# EAGLE design stonyman-imager-board (EAGLE 6.5.0)
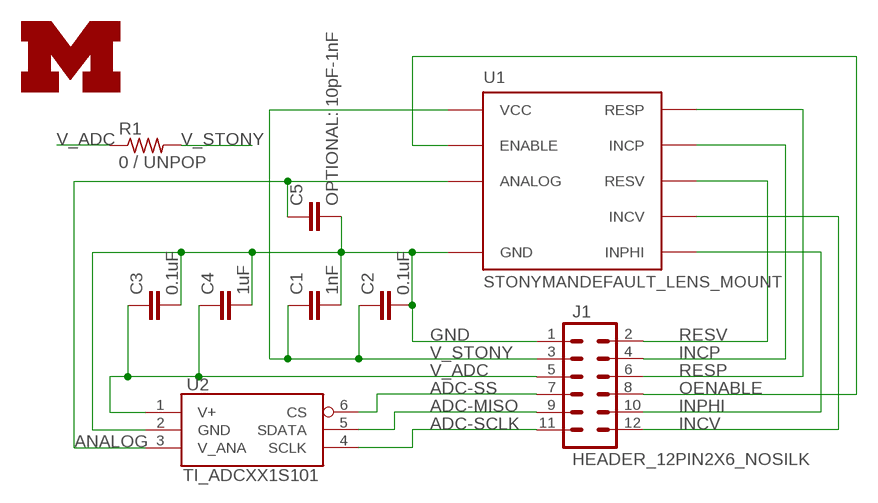
[diagram p0: schematic, sheet 1]

## Parts
C1  1nF  C-EUC0603  [C0603]
C2  0.1uF  C-EUC0603  [C0603]
C3  0.1uF  C-EUC0603  [C0603]
C4  1uF  C-EUC0603  [C0603]
C5  OPTIONAL: 10pF-1nF  C-EUC0603  [C0603]
J1  HEADER_12PIN2X6_NOSILK  [HEADER2X6/0.05IN_NO_SILK]
R1  0 / UNPOP  R-US_R0603  [R0603]
U1  STONYMANDEFAULT_LENS_MOUNT  [STONYMAN_DEFAULT_LENS]
U2  TI_ADCXX1S101  [SOT23-6]
U$1  UMICH_SOLID_SMALL  [UMICH_SOLID_75MIL]

## Nets
ADC-MISO: J1.9 U2.5(SDATA)
ADC-SCLK: J1.11 U2.4(SCLK)
ADC-SS: J1.7 U2.6(CS)
ANALOG: C5.1 U1.P$8(ANALOG) U2.3(V_ANA)
GND: C1.2 C2.2 C3.2 C4.2 C5.2 J1.1 U1.P$1(GND) U1.P$10(GND) U2.2(GND)
INCP: J1.4 U1.P$4(INCP)
INCV: J1.12 U1.P$6(INCV)
INPHI: J1.10 U1.P$7(INPHI)
OENABLE: J1.8 U1.P$9(ENABLE)
RESP: J1.6 U1.P$3(RESP)
RESV: J1.2 U1.P$5(RESV)
V_ADC: C3.1 C4.1 J1.5 R1.1 U2.1(V+)
V_STONY: C1.1 C2.1 J1.3 R1.2 U1.P$2(VCC)

## Library data of the parts
C1-C5 = rcl:C-EU: CAPACITOR, European symbol
J1 = senseye:HEADER_12PIN
R1 = rcl:R-US_: RESISTOR, American symbol
U1 = senseye:STONYMAN: Centeye Stonyman imager chip
U2 = senseye:TI_ADCXX1S101: Texas Instruments ADCXX1S101 (ADC081S101, ADC101S101, ADC121S101) Single Channel, 0.5 to 1.0 Msps, 8-bit, 10-bit and 12-bit A/D Converters
U$1 = logos:UMICH_SOLID

## Board
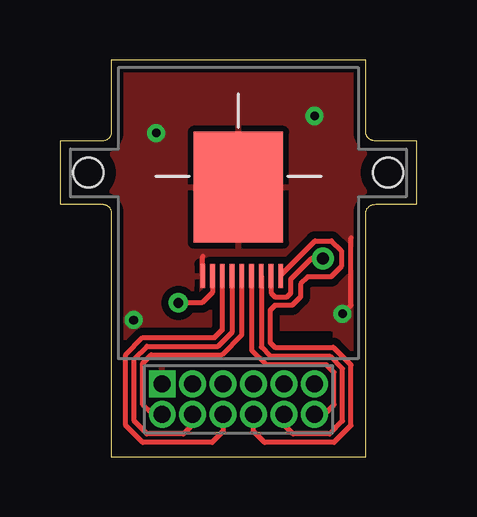
[diagram p1: board, top side]
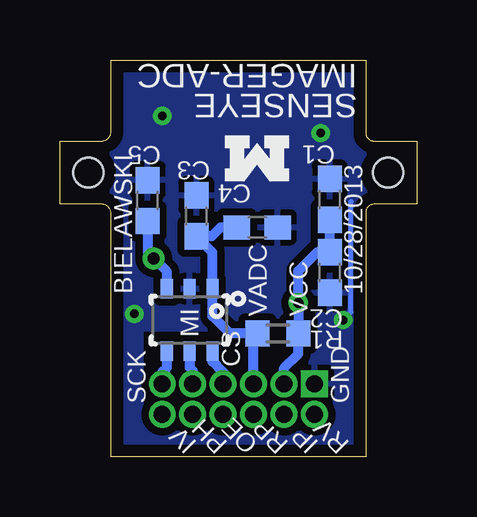
[diagram p2: board, bottom side, seen from below]

Size 14.88 x 16.56 mm. Coordinates in mm from the lower left corner, seen from the top.
Outline: 2.13,0 12.75,0 12.75,10.14 arc-90 13.15,10.54 14.88,10.54 14.88,13.18 13.15,13.18 arc-90 12.75,13.58 12.75,16.56 2.13,16.56 2.13,13.52 arc-90 1.79,13.18 0,13.18 0,10.54 1.79,10.54 arc-90 2.13,10.2 2.13,0
Copper layers (1*16): Top 0.0178mm / dielectric 59mil / Bottom 0.0178mm
Design rules "sunstone-2lyr_v1.0.0.3 *": minimum track width 6mil, minimum drill 14mil, track to track 6mil, track to pad 6mil, pad to pad 6mil, via to via 6mil, smd to smd 6mil, copper to edge 20mil, drill to drill 16mil, minimum pad ring 8mil, minimum via ring 8mil, stop-mask expansion 3mil, vias tented up to drill 16mil, thermal gap 10mil
Holes 1.24 mm at 13.69,11.86 1.19,11.86

### Footprints (pad centres in the part's own frame; a part is rotated, then mirrored left to right if it is on the bottom)
C0603 = smd 1.1 x 1: 1 -0.85,0; 2 0.85,0
HEADER2X6/0.05IN_NO_SILK = drill 0.711 pad 1.016 square: 1 -3.175,0.635 | drill 0.711 pad 1.016: 2 -3.175,-0.635; 3 -1.905,0.635; 4 -1.905,-0.635; 5 -0.635,0.635; 6 -0.635,-0.635; 7 0.635,0.635; 8 0.635,-0.635; 9 1.905,0.635; 10 1.905,-0.635; 11 3.175,0.635; 12 3.175,-0.635
R0603 = smd 1 x 1.1: 1 -0.85,0; 2 0.85,0
STONYMAN_DEFAULT_LENS = smd 0.2 x 1: P$1 -1.487,-3.707; P$2 -1.08,-3.707; P$3 -0.673,-3.707; P$4 -0.266,-3.707; P$5 0.141,-3.707; P$6 0.548,-3.707; P$7 0.955,-3.707; P$8 1.362,-3.707; P$9 1.769,-3.707 | smd 3.73 x 4.63: P$10 0,0
SOT23-6 = smd 0.8 x 0.51: 1 -1.3,0.95; 2 -1.3,0; 3 -1.3,-0.95; 4 1.3,-0.95; 5 1.3,0; 6 1.3,0.95

### Placement (x,y rotation side)
C1  3.63,10.74 90 bottom
C2  3.63,7.7 270 bottom
C3  9.19,10.06 90 bottom
C4  6.65,9.58 0 bottom
C5  11.23,10.69 90 bottom
J1  7.44,2.41 0 top
R1  5.79,5.16 0 bottom
U1  7.44,11.25 0 top
U2  9.47,5.71 270 bottom
U$1  5.33,13.41 180 bottom

### Tracks (layer width: path | path; a pad name or v marks a point on that pad's centre or on a via)
ADC-MISO
  Bottom 0.406: U2.5 9.47,3.73 9.35,3.61 J1.9
ADC-SCLK
  Bottom 0.406: J1.11 10.62,3.53 10.42,3.72 U2.4
ADC-SS
  Bottom 0.406: J1.7 8.08,3.53 8.52,3.98 U2.6
ANALOG  (via drill 0.51)
  Top 0.203: U1.P$8 8.8,6.84 8.97,6.68 9.47,6.68 9.63,6.83 9.63,7.42 10.49,8.28 v10.97,8.28
  Bottom 0.406: U2.3 10.42,7.73 v10.97,8.28 11.23,8.53 C5.1
GND  (via drill 0.36 pad 0.25)
  Top 0.203: U1.P$1 5.96,8.37 | v11.79,5.97 12.14,6.33 12.14,9.14
  Bottom 0.203: v3.07,5.71 2.74,6.04 2.74,10.67
  other vias: 10.62,14.22 4.01,13.51
  pour Top (isolate 0.305): 12.9,16.71 12.9,13.64 15.09,13.64 15.09,10.06 12.9,10.06 12.9,6.25 11.35,6.25 11.35,5.33 7.26,5.33 7.26,1.8 11.48,1.8 11.48,6.12 12.9,6.12 12.9,-0.18 1.96,-0.18 1.96,10.16 -0.15,10.16 -0.15,13.56 1.98,13.56 1.98,16.71
  pour Bottom (isolate 0.305): 1.98,16.71 12.9,16.71 12.9,13.64 15.09,13.64 15.09,10.06 12.9,10.06 12.9,6.25 11.35,6.25 11.35,5.33 7.29,5.33 7.29,1.8 11.48,1.8 11.48,6.12 12.9,6.12 12.9,-0.18 1.96,-0.18 1.96,10.16 -0.15,10.16 -0.15,13.56 1.98,13.56
INCP
  Top 0.203: J1.4 5.54,1.35 5.16,0.96 3.63,0.96 3.1,1.5 3.1,4.09 3.63,4.62 6.6,4.62 7.18,5.2 U1.P$4
INCV
  Top 0.203: U1.P$6 7.99,4.46 8.59,3.86 11.1,3.86 11.43,3.53 11.43,2.18 11.02,1.78 J1.12
INPHI
  Top 0.203: J1.10 9.35,1.35 9.73,0.96 11.25,0.96 11.79,1.5 11.79,3.68 11.25,4.22 8.76,4.22 8.4,4.58 U1.P$7
OENABLE
  Top 0.203: J1.8 8.08,1.07 8.53,0.61 11.43,0.61 12.14,1.32 12.14,3.83 11.4,4.57 8.97,4.57 8.76,4.78 8.76,6.12 8.97,6.33 9.68,6.33 10.03,6.68 10.03,7.21 10.34,7.52 11.3,7.52 11.73,7.95 11.73,8.61 11.33,9.02 10.64,9.02 9.34,7.71 | 9.34,7.71 9.21,7.58 U1.P$9 | 9.21,7.71 9.34,7.71
RESP
  Top 0.203: J1.6 6.81,1.07 6.35,0.61 3.45,0.61 2.74,1.32 2.74,4.27 3.45,4.98 6.45,4.98 6.77,5.3 U1.P$3
RESV
  Top 0.203: J1.2 3.86,1.78 3.45,2.18 3.45,3.91 3.81,4.27 6.76,4.27 7.58,5.09 U1.P$5
V_ADC
  Bottom 0.406: C4.1 8.18,9.58 8.55,9.21 C3.1 8.52,8.54 U2.1 8.52,5.88 7.8,5.16 R1.1 6.81,4.99 J1.5
V_STONY  (via drill 0.41)
  Top 0.203: U1.P$2 6.36,6.87 5.92,6.43 v4.94,6.43
  Bottom 0.406: C1.1 C2.1 4.15,8.55 4.94,7.76 v4.94,6.43 R1.2 4.94,4.3 5.54,3.71 J1.3

### Text on the board
bPlace: IMAGER-ADC | SENSEYE | 10/28/2013 | BIELAWSKI | VCC | VADC | MI | CS | GND | SCK | RV | IP | RP | OE | PH | IV